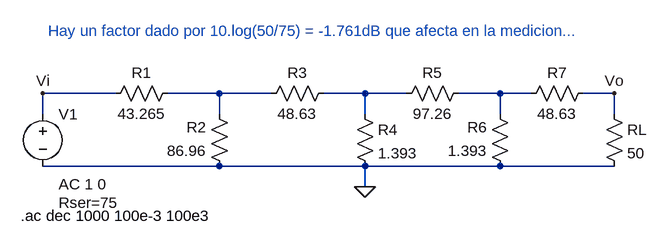
[diagram p0: schematic 2-2.asc]
2-2.asc, the LTspice schematic file:
Version 4
SHEET 1 880 680
WIRE -16 128 -128 128
WIRE 144 128 64 128
WIRE 224 128 144 128
WIRE 368 128 304 128
WIRE 432 128 368 128
WIRE 576 128 512 128
WIRE 624 128 576 128
WIRE 752 128 704 128
WIRE -128 160 -128 128
WIRE 144 160 144 128
WIRE 368 160 368 128
WIRE 576 160 576 128
WIRE 752 160 752 128
WIRE 144 240 -128 240
WIRE 368 240 144 240
WIRE 576 240 368 240
WIRE 752 240 576 240
WIRE 368 272 368 240
FLAG -128 128 Vi
FLAG 752 128 Vo
FLAG 368 272 0
SYMBOL res 80 112 R90
WINDOW 0 0 56 VBottom 2
WINDOW 3 32 56 VTop 2
SYMATTR InstName R1
SYMATTR Value 43.265
SYMBOL res 160 256 R180
WINDOW 0 36 76 Left 2
WINDOW 3 36 40 Left 2
SYMATTR InstName R2
SYMATTR Value 86.96
SYMBOL res 208 144 R270
WINDOW 0 32 56 VTop 2
WINDOW 3 0 56 VBottom 2
SYMATTR InstName R3
SYMATTR Value 48.63
SYMBOL res 352 144 R0
SYMATTR InstName R4
SYMATTR Value 1.393
SYMBOL res 528 112 R90
WINDOW 0 0 56 VBottom 2
WINDOW 3 32 56 VTop 2
SYMATTR InstName R5
SYMATTR Value 97.26
SYMBOL res 592 256 R180
WINDOW 0 36 76 Left 2
WINDOW 3 36 40 Left 2
SYMATTR InstName R6
SYMATTR Value 1.393
SYMBOL res 608 144 R270
WINDOW 0 32 56 VTop 2
WINDOW 3 0 56 VBottom 2
SYMATTR InstName R7
SYMATTR Value 48.63
SYMBOL res 736 144 R0
SYMATTR InstName RL
SYMATTR Value 50
SYMBOL voltage -128 144 R0
WINDOW 123 24 124 Left 2
WINDOW 39 24 152 Left 2
SYMATTR InstName V1
SYMATTR Value ""
SYMATTR Value2 AC 1 0
SYMATTR SpiceLine Rser=75
TEXT -162 316 Left 2 !.ac dec 1000 100e-3 100e3
TEXT -120 32 Left 2 ;Hay un factor dado por 10.log(50/75) = -1.761dB que afecta en la medicion...

The netlist it stands for:
* 2-2.asc
R1 N001 Vi 43.265
R2 0 N001 86.96
R3 N001 N002 48.63
R4 N002 0 1.393
R5 N003 N002 97.26
R6 0 N003 1.393
R7 N003 Vo 48.63
RL Vo 0 50
V1 Vi 0 AC 1 0 Rser=75
.ac dec 1000 100e-3 100e3
* Hay un factor dado por 10.log(50/75) = -1.761dB que afecta en la medicion...
.backanno
.end